# EAGLE design DTLJ_hexIO_v2 (EAGLE 7.2.0)
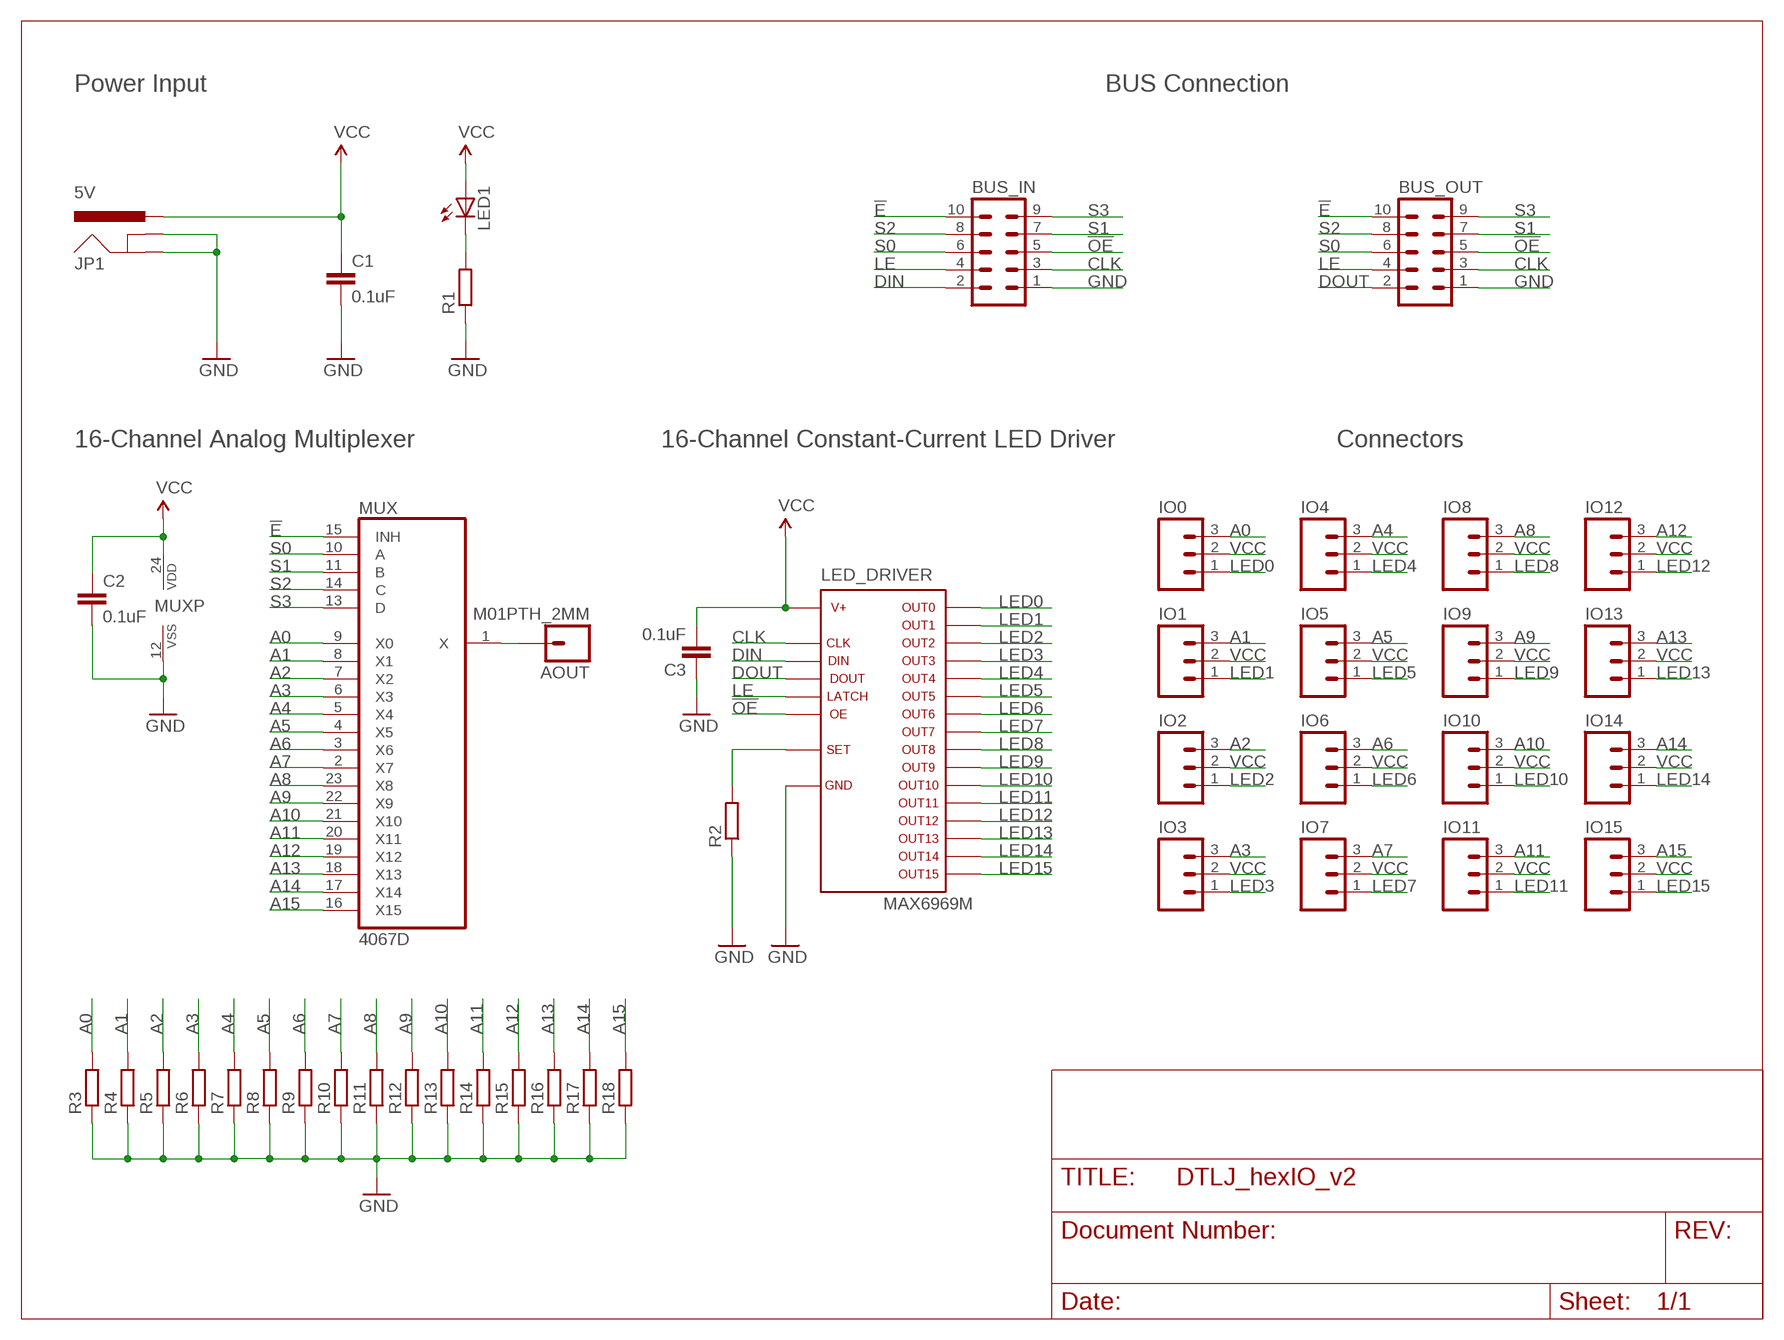
[diagram p0: schematic, sheet 1]

## Parts
AOUT  M01PTH_2MM  [1X01_2MM]
BUS_IN  ML10  [ML10]
BUS_OUT  ML10  [ML10]
C1  0.1uF  C-EUC1206  [C1206]
C2  0.1uF  C-EUC1206  [C1206]
C3  0.1uF  C-EUC1206  [C1206]
IO0  M03POLAR  [MOLEX-1X3]
IO1  M03POLAR  [MOLEX-1X3]
IO2  M03POLAR  [MOLEX-1X3]
IO3  M03POLAR  [MOLEX-1X3]
IO4  M03POLAR  [MOLEX-1X3]
IO5  M03POLAR  [MOLEX-1X3]
IO6  M03POLAR  [MOLEX-1X3]
IO7  M03POLAR  [MOLEX-1X3]
IO8  M03POLAR  [MOLEX-1X3]
IO9  M03POLAR  [MOLEX-1X3]
IO10  M03POLAR  [MOLEX-1X3]
IO11  M03POLAR  [MOLEX-1X3]
IO12  M03POLAR  [MOLEX-1X3]
IO13  M03POLAR  [MOLEX-1X3]
IO14  M03POLAR  [MOLEX-1X3]
IO15  M03POLAR  [MOLEX-1X3]
JP1  5V  POWER_JACKPTH_BREAD  [POWER_JACK_PTH_BREAD]
LED1  LEDSMT1206  [1206]
LED_DRIVER  MAX6969M  [SO24W]
MUX  4067D  [SO24W]
R1  R-EU_R1206  [R1206]
R2  R-EU_R1206  [R1206]
R3  R-EU_R1206  [R1206]
R4  R-EU_R1206  [R1206]
R5  R-EU_R1206  [R1206]
R6  R-EU_R1206  [R1206]
R7  R-EU_R1206  [R1206]
R8  R-EU_R1206  [R1206]
R9  R-EU_R1206  [R1206]
R10  R-EU_R1206  [R1206]
R11  R-EU_R1206  [R1206]
R12  R-EU_R1206  [R1206]
R13  R-EU_R1206  [R1206]
R14  R-EU_R1206  [R1206]
R15  R-EU_R1206  [R1206]
R16  R-EU_R1206  [R1206]
R17  R-EU_R1206  [R1206]
R18  R-EU_R1206  [R1206]

## Nets
!E: BUS_IN.10 BUS_OUT.10 MUX.15(INH)
!OE: BUS_IN.5 BUS_OUT.5 LED_DRIVER.21
A0: IO0.3 MUX.9(X0) R3.2
A1: IO1.3 MUX.8(X1) R4.2
A2: IO2.3 MUX.7(X2) R5.2
A3: IO3.3 MUX.6(X3) R6.2
A4: IO4.3 MUX.5(X4) R7.2
A5: IO5.3 MUX.4(X5) R8.2
A6: IO6.3 MUX.3(X6) R9.2
A7: IO7.3 MUX.2(X7) R10.2
A8: IO8.3 MUX.23(X8) R11.2
A9: IO9.3 MUX.22(X9) R12.2
A10: IO10.3 MUX.21(X10) R13.2
A11: IO11.3 MUX.20(X11) R14.2
A12: IO12.3 MUX.19(X12) R15.2
A13: IO13.3 MUX.18(X13) R16.2
A14: IO14.3 MUX.17(X14) R17.2
A15: IO15.3 MUX.16(X15) R18.2
CLK: BUS_IN.3 BUS_OUT.3 LED_DRIVER.3
DIN: BUS_IN.2 LED_DRIVER.2
DOUT: BUS_OUT.2 LED_DRIVER.22
GND [power]: BUS_IN.1 BUS_OUT.1 C1.2 C2.2 C3.1 JP1.GND JP1.GNDBREAK LED_DRIVER.1 MUX.12(VSS) R1.1 R2.1 R3.1 R4.1 R5.1 R6.1 R7.1 R8.1 R9.1 R10.1 R11.1 R12.1 R13.1 R14.1 R15.1 R16.1 R17.1 R18.1
LE: BUS_IN.4 BUS_OUT.4 LED_DRIVER.4
LED0: IO0.1 LED_DRIVER.5
LED1: IO1.1 LED_DRIVER.6
LED2: IO2.1 LED_DRIVER.7
LED3: IO3.1 LED_DRIVER.8
LED4: IO4.1 LED_DRIVER.9
LED5: IO5.1 LED_DRIVER.10
LED6: IO6.1 LED_DRIVER.11
LED7: IO7.1 LED_DRIVER.12
LED8: IO8.1 LED_DRIVER.13
LED9: IO9.1 LED_DRIVER.14
LED10: IO10.1 LED_DRIVER.15
LED11: IO11.1 LED_DRIVER.16
LED12: IO12.1 LED_DRIVER.17
LED13: IO13.1 LED_DRIVER.18
LED14: IO14.1 LED_DRIVER.19
LED15: IO15.1 LED_DRIVER.20
N$1: LED1.C R1.2
N$2: LED_DRIVER.23 R2.2
N$3: AOUT.1 MUX.1(X)
S0: BUS_IN.6 BUS_OUT.6 MUX.10(A)
S1: BUS_IN.7 BUS_OUT.7 MUX.11(B)
S2: BUS_IN.8 BUS_OUT.8 MUX.14(C)
S3: BUS_IN.9 BUS_OUT.9 MUX.13(D)
VCC [power]: C1.1 C2.1 C3.2 IO0.2 IO1.2 IO2.2 IO3.2 IO4.2 IO5.2 IO6.2 IO7.2 IO8.2 IO9.2 IO10.2 IO11.2 IO12.2 IO13.2 IO14.2 IO15.2 JP1.PWR LED1.A LED_DRIVER.24 MUX.24(VDD)

## Notes on the sheet
- Power Input | BUS Connection
- 16-Channel Analog Multiplexer | 16-Channel Constant-Current LED Driver | Connectors

## Library data of the parts
AOUT = SparkFun-Connectors:M01: Header 1 Standard 1-pin 0.1" header. Use with straight break away headers (SKU : PRT-00116), right angle break away headers (PRT-00553), swiss pins (PRT-00743), machine pins (PRT-00117), and female headers (PRT-00115).
BUS_IN BUS_OUT = con-ml:ML10: HARTING; OC_FARNELL: unknown; OC_NEWARK: unknown
C1-C3 = rcl:C-EU: CAPACITOR, European symbol
IO0 IO1-IO15 = SparkFun-Connectors:M03: Header 3 Standard 3-pin 0.1" header. Use with straight break away headers (SKU : PRT-00116), right angle break away headers (PRT-00553), swiss pins (PRT-00743), machine pins (PRT-00117), and female headers (PRT-00115). Molex polarized connector foot print use with SKU : PRT-08232 with associated crimp pins and housings.
JP1 = SparkFun-Connectors:POWER_JACK: Power Jack This is the standard 5.5mm barrel jack for power. The PTH is the most common, proven, reliable, footprint. The Slot footprint only works if the mill layer is transmitted to the PCB fab house so be warned. Mating wall wart : TOL-00298 (and others); PROD_ID: PRT-10811
LED1 = led:LED: LED OSRAM: - CHIPLED LG R971, LG N971, LY N971, LG Q971, LY Q971, LO R971, LY R971 LH N974, LH R974 LS Q976, LO Q976, LY Q976 LO Q996 - Hyper CHIPLED LW Q18S LB Q993, LB Q99A, LB R99A - SideLED LS A670, LO A670, LY A670, LG A670, LP A670 LB A673, LV A673, LT A673, LW A673 LH A674 LY A675 LS A676, LA A676, LO A676, LY A676, LW A676 LS A679, LY A679, LG A679 - Hyper Micro SIDELED® LS Y876, LA Y876, LO Y876, LY Y876 LT Y87S - SmartLED LW L88C, LW L88S LB L89C, LB L89S, LG L890 LS L89K, LO L89K, LY L89K LS L896, LA L896, LO L896, LY L896 - TOPLED LS T670, LO T670, LY T670, LG T670, LP T670 LSG T670, LSP T670, LSY T670, LOP T670, LYG T670 LG T671, LOG T671, LSG T671 LB T673, LV T673, LT T673, LW T673 LH T674 LS T676, LA T676, LO T676, LY T676, LB T676, LH T676, LSB T676, LW T676 LB T67C, LV T67C, LT T67C, LS T67K, LO T67K, LY T67K, LW E67C LS E67B, LA E67B, LO E67B, LY E67B, LB E67C, LV E67C, LT E67C LW T67C LS T679, LY T679, LG T679 LS T770, LO T770, LY T770, LG T770, LP T770 LB T773, LV T773, LT T773, LW T773 LH T774 LS E675, LA E675, LY E675, LS T675 LS T776, LA T776, LO T776, LY T776, LB T776 LHGB T686 LT T68C, LB T68C - Hyper Mini TOPLED® LB M676 - Mini TOPLED Santana® LG M470 LS M47K, LO M47K, LY M47K Source: http://www.osram.convergy.de LUXEON: - LUMILED® LXK2-PW12-R00, LXK2-PW12-S00, LXK2-PW14-U00, LXK2-PW14-V00 LXK2-PM12-R00, LXK2-PM12-S00, LXK2-PM14-U00 LXK2-PE12-Q00, LXK2-PE12-R00, LXK2-PE12-S00, LXK2-PE14-T00, LXK2-PE14-U00 LXK2-PB12-K00, LXK2-PB12-L00, LXK2-PB12-M00, LXK2-PB14-N00, LXK2-PB14-P00, LXK2-PB14-Q00 LXK2-PR12-L00, LXK2-PR12-M00, LXK2-PR14-Q00, LXK2-PR14-R00 LXK2-PD12-Q00, LXK2-PD12-R00, LXK2-PD12-S00 LXK2-PH12-R00, LXK2-PH12-S00 LXK2-PL12-P00, LXK2-PL12-Q00, LXK2-PL12-R00 Source: www.luxeon.com KINGBRIGHT: KA-3528ASYC Source: www.kingbright.com
LED_DRIVER = max6969:MAX6969
MUX = 40xx:4067: 16-channel ANALOG MULTIPLEXER
R1-R18 = rcl:R-EU_: RESISTOR, European symbol

## Net classes
0 default: width 0.508 mm, drill 0.33 mm, clearance 0.254 mm
1 power: width 0.889 mm, drill 0.33 mm, clearance 0.381 mm

## Board
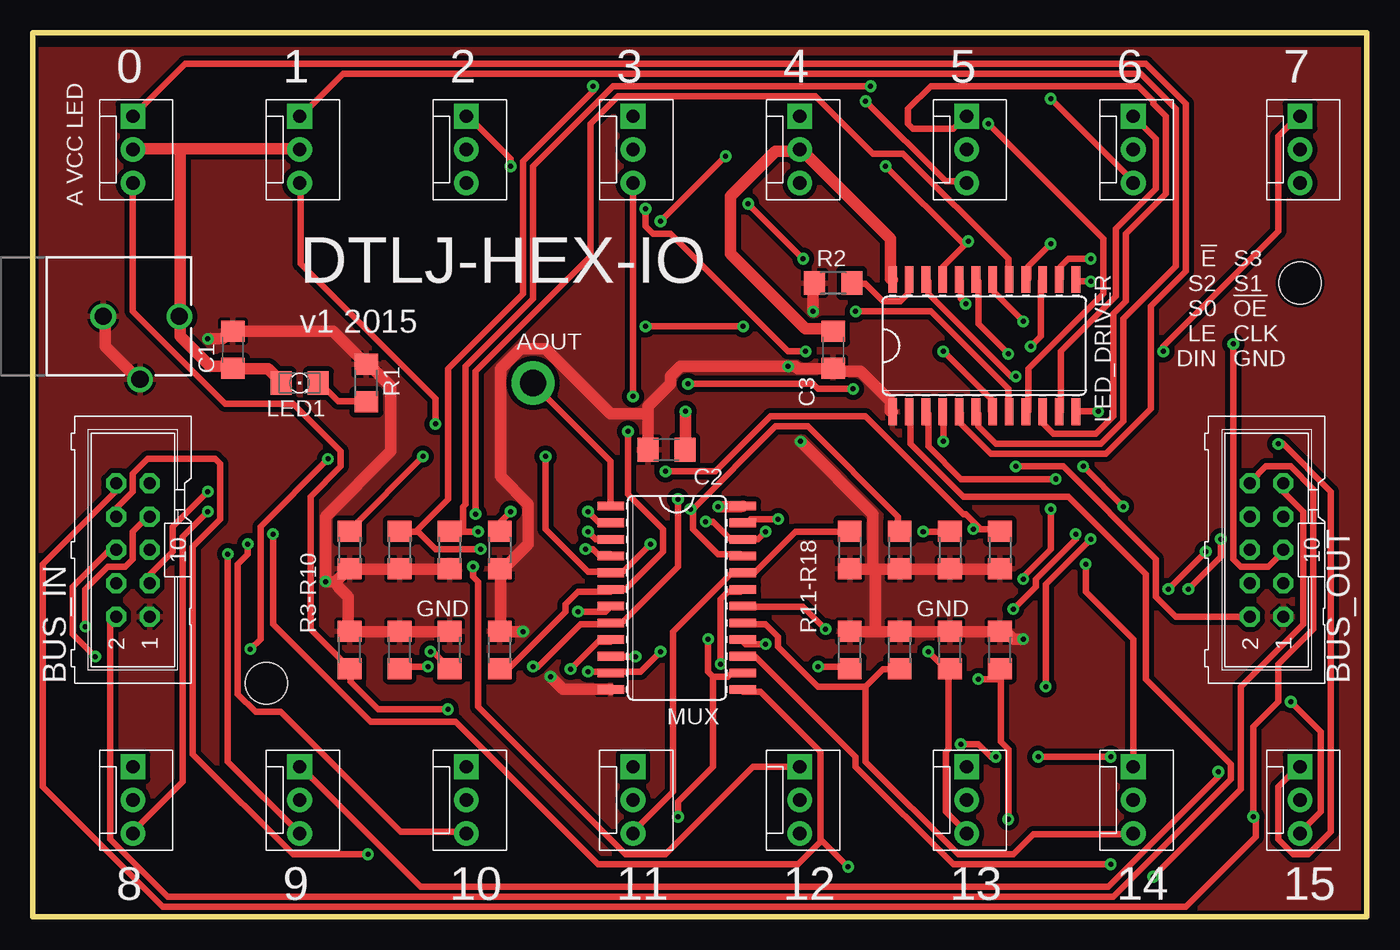
[diagram p1: board, top side]
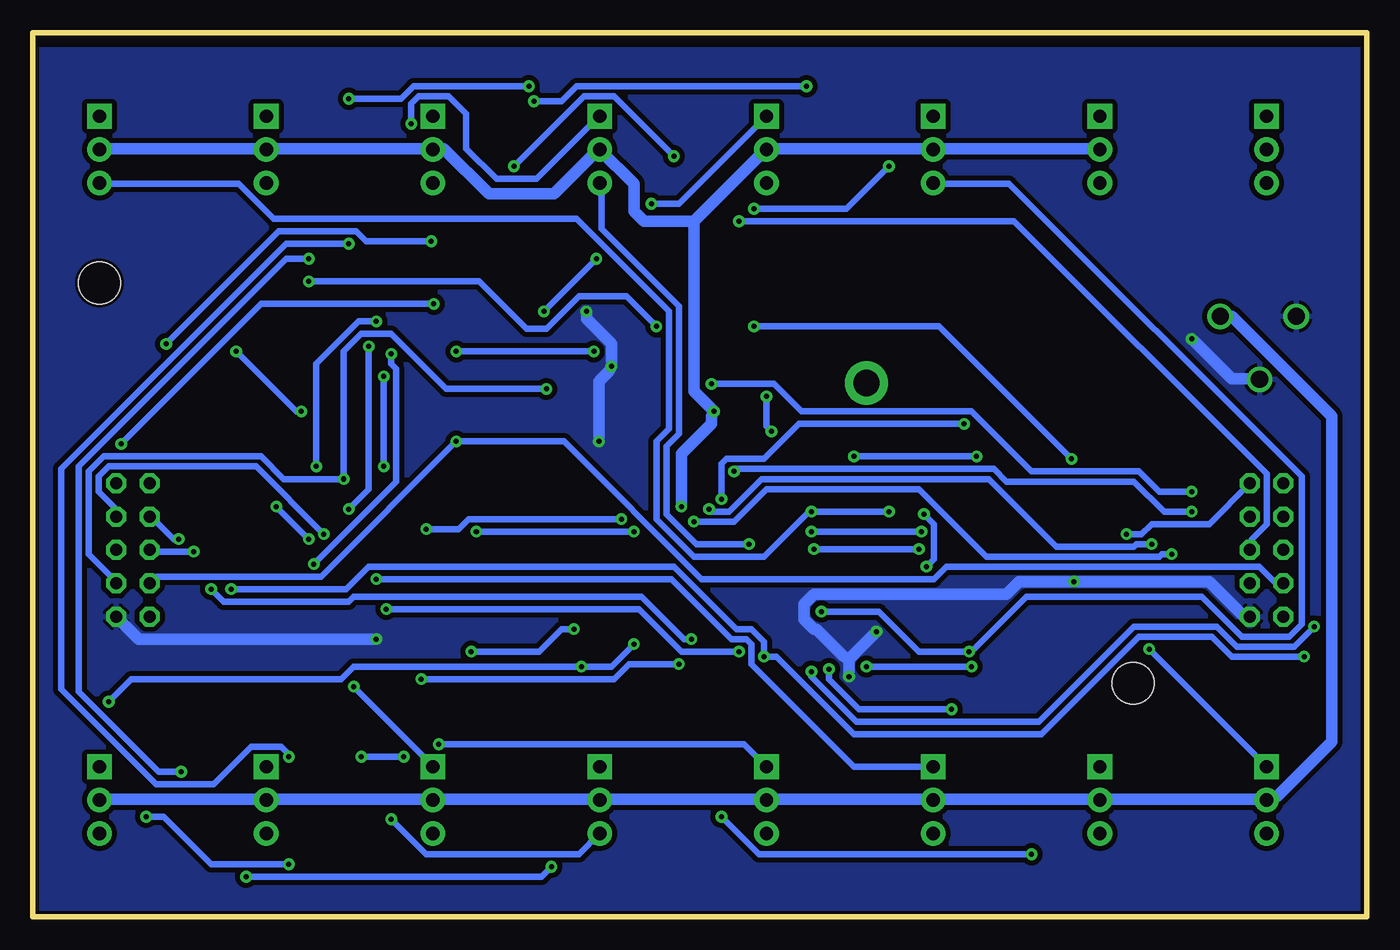
[diagram p2: board, bottom side, seen from below]

Size 101.6 x 67.31 mm. Coordinates in mm from the lower left corner, seen from the top.
Outline: 0,2.54 0,0
Outline: 0,0 101.6,0 101.6,67.31 0,67.31 0,0
Copper layers (1*16): Top 0.035mm / dielectric 1.5mm / Bottom 0.035mm
Design rules "20trace-10clearance": minimum track width 20mil, minimum drill 15mil, track to track 10mil, track to pad 10mil, pad to pad 10mil, via to via 10mil, smd to smd 10mil, copper to edge 10mil, drill to drill 10mil, minimum pad ring 12mil, minimum via ring 10mil, stop-mask expansion 4mil, vias tented up to drill 20mil, thermal gap 10mil
Holes 3.2 mm at 96.52,48.26 17.78,17.78

### Footprints (pad centres in the part's own frame; a part is rotated, then mirrored left to right if it is on the bottom)
1X01_2MM = drill 2 pad 3.302: 1 0,0
ML10 = drill 0.914 octagon: 1 -5.08,-1.27; 2 -5.08,1.27; 3 -2.54,-1.27; 4 -2.54,1.27; 5 0,-1.27; 6 0,1.27; 7 2.54,-1.27; 8 2.54,1.27; 9 5.08,-1.27; 10 5.08,1.27
C1206 = smd 1.6 x 1.8: 1 -1.4,0; 2 1.4,0
MOLEX-1X3 = drill 1.016 pad 1.88 square: 1 0,0 | drill 1.016 pad 1.88: 2 2.54,0; 3 5.08,0
POWER_JACK_PTH_BREAD = drill 1.3: GND 0,7.9; GNDBREAK 4.8,10.7; PWR 0,13.7
1206 = smd 1.6 x 1.803: A -1.422,0; C 1.422,0
SO24W = smd 0.66 x 2.032: 1 -6.985,-5.029; 2 -5.715,-5.029; 3 -4.445,-5.029; 4 -3.175,-5.029; 5 -1.905,-5.029; 6 -0.635,-5.029; 7 0.635,-5.029; 8 1.905,-5.029; 9 3.175,-5.029; 10 4.445,-5.029; 11 5.715,-5.029; 12 6.985,-5.029; 13 6.985,5.029; 14 5.715,5.029; 15 4.445,5.029; 16 3.175,5.029; 17 1.905,5.029; 18 0.635,5.029; 19 -0.635,5.029; 20 -1.905,5.029; 21 -3.175,5.029; 22 -4.445,5.029; 23 -5.715,5.029; 24 -6.985,5.029
R1206 = smd 1.6 x 1.803: 1 -1.422,0; 2 1.422,0

### Placement (x,y rotation side)
AOUT  38.1,40.64 0 top
BUS_IN  7.62,27.94 90 top
BUS_OUT  93.98,27.94 90 top
C1  15.24,43.18 90 top
C2  48.26,35.56 180 top
C3  60.96,43.18 90 top
IO0  7.62,60.96 270 top
IO1  20.32,60.96 270 top
IO2  33.02,60.96 270 top
IO3  45.72,60.96 270 top
IO4  58.42,60.96 270 top
IO5  71.12,60.96 270 top
IO6  83.82,60.96 270 top
IO7  96.52,60.96 270 top
IO8  7.62,11.43 270 top
IO9  20.32,11.43 270 top
IO10  33.02,11.43 270 top
IO11  45.72,11.43 270 top
IO12  58.42,11.43 270 top
IO13  71.12,11.43 270 top
IO14  83.82,11.43 270 top
IO15  96.52,11.43 270 top
JP1  -2.54,45.72 270 top
LED1  20.32,40.64 0 top
LED_DRIVER  72.47,43.49 0 top
MUX  49.05,24.29 270 top
R1  25.4,40.64 270 top
R2  60.96,48.26 0 top
R3  24.13,20.32 270 top
R4  27.94,20.32 270 top
R5  31.75,20.32 270 top
R6  35.56,20.32 270 top
R7  24.13,27.94 90 top
R8  27.94,27.94 90 top
R9  31.75,27.94 90 top
R10  35.56,27.94 90 top
R11  73.66,27.94 90 top
R12  69.85,27.94 90 top
R13  66.04,27.94 90 top
R14  62.23,27.94 90 top
R15  73.66,20.32 270 top
R16  69.85,20.32 270 top
R17  66.04,20.32 270 top
R18  62.23,20.32 270 top

### Tracks (layer width: path | path; a pad name or v marks a point on that pad's centre or on a via)
!E  (via drill 0.38)
  Top 0.508: v82.11,4 70.1,4 62.67,11.43 62.67,12.19 55.05,19.81 54.1,19.81 MUX.15 | BUS_OUT.10 92.77,33.15 93.92,34.29 95.82,34.29 97.54,32.58 97.54,21.91 94.87,19.24 94.87,16.38 92.96,14.48 v92.96,7.62 93.15,7.62 93.15,6.1 87.82,0.76 9.91,0.76 0.76,9.91 0.76,26.86 6.29,32.38 6.29,32.96 BUS_IN.10
  Bottom 0.508: v82.11,4 88.01,4 91.63,7.62 v92.96,7.62
!OE  (via drill 0.38)
  Top 0.508: v91.44,43.62 91.44,27.24 92.01,26.67 94.11,26.67 95.25,27.81 BUS_OUT.5 | LED_DRIVER.21 69.34,48.58 69.34,49.53 v71.25,51.44 70.87,51.24 v64.96,57.15 | v52.77,57.91 v47.82,52.96
  Bottom 0.508: v71.25,51.44 76.2,51.44 76.96,52.2 82.87,52.2 v91.44,43.62 | v47.82,52.96 26.86,52.96 7.62,33.72 7.62,29.91 8.76,28.77 8.76,28 BUS_IN.5 | v52.77,57.91 57.34,62.48 59.63,62.48 v64.96,57.15
A0  (via drill 0.38)
  Top 0.508: IO0.3 7.62,46.1 14.67,39.05 19.81,39.05 23.43,35.43 23.43,34.29 21.14,32 21.14,21.91 24,19.05 R3.2 24.19,18.67 24.19,17.91 26.29,15.81 v31.62,15.81 | v40.96,18.86 43.05,20.95 44.01,20.95 MUX.9
  Bottom 0.508: v40.96,18.86 40.96,18.1 38.67,15.81 v31.62,15.81
A1  (via drill 0.38)
  Top 0.508: v30.1,19.05 28,19.05 R4.2 | v38.1,19.05 38.48,19.05 41.72,22.29 44.01,22.29 MUX.8 44.2,22.48 44.96,22.48 49.15,26.67 v49.15,31.81 | v30.67,37.53 30.67,39.43 20.38,49.72 20.38,55.82 IO1.3
  Bottom 0.508: v38.1,19.05 v30.1,19.05 | v30.67,37.53 43.24,37.53 45.91,34.86 48.77,34.86 49.15,34.48 v49.15,31.81
A2  (via drill 0.38)
  Top 0.508: v30.29,20.19 30.48,20.19 31.62,19.05 R5.2 | v41.53,23.24 43.62,23.24 44.01,23.62 MUX.7
  Bottom 0.508: v41.53,23.24 37.15,23.24 34.1,20.19 v30.29,20.19 30.1,20.19 25.91,24.38 12.57,24.38 9.53,21.34 5.91,21.34 4.95,22.29 4.95,33.53 27.24,55.82 32.96,55.82 IO2.3
A3  (via drill 0.38)
  Top 0.508: R6.2 35.62,19.05 36.39,19.05 40.58,23.24 40.58,23.81 41.53,24.77 44.01,24.77 MUX.6 44.2,24.96 45.15,24.96 48.01,27.81 48.01,29.53 45.34,32.19 v45.34,36.96 | v45.72,39.62 IO3.3
  Bottom 0.508: v45.72,39.62 45.72,37.34 v45.34,36.96
A4  (via drill 0.38)
  Top 0.508: v29.72,35.05 24.19,29.53 R7.2 | v39.05,35.05 39.05,29.53 42.29,26.29 44.01,26.29 MUX.5 44.2,26.29 44.96,26.29 v47.05,28.38
  Bottom 0.508: v39.05,35.05 v29.72,35.05 | v47.05,28.38 51.05,28.38 53.34,30.67 53.34,35.81 52.39,36.77 52.39,46.48 58.29,52.39 58.29,55.82 IO4.3
A5  (via drill 0.38)
  Top 0.508: 29.34,29.34 28,29.34 R8.2 | 29.34,29.34 30.67,28 v34.1,28 | v42.1,28 42.67,28 43.05,27.62 44.01,27.62 MUX.4 | v63.44,62.1 69.53,56.01 71.06,56.01 IO5.3 | v42.67,63.25 42.67,62.87 37.34,57.53 37.34,47.43 31.62,41.72 31.62,31.81 29.34,29.53 29.34,29.34
  Bottom 0.508: v42.1,28 v34.1,28 | v63.44,62.1 61.34,62.1 60.2,63.25 v42.67,63.25
A6  (via drill 0.38)
  Top 0.508: v33.91,29.34 32.77,29.34 | 32.77,29.34 31.81,29.34 R9.2 | v42.29,29.34 42.86,28.77 44.01,28.77 MUX.3 | v77.53,62.29 83.82,56.01 IO6.3 | v63.82,63.25 44.2,63.25 38.1,57.15 38.1,47.05 32.96,41.91 32.96,31.43 32.77,31.24 32.77,29.34
  Bottom 0.508: v42.29,29.34 v33.91,29.34 | v77.53,62.29 73.53,62.29 72.58,63.25 v63.82,63.25
A7  (via drill 0.38)
  Top 0.508: v36.39,30.86 35.62,30.1 35.62,29.53 R10.2 | v42.29,30.86 43.05,30.1 44.01,30.1 MUX.2
  Bottom 0.508: v36.39,30.86 v42.29,30.86 42.48,30.86 45.91,27.43 51.24,27.43 54.1,30.29 54.1,36.2 53.15,37.15 53.15,46.1 60.2,53.15 83.25,53.15 85.92,55.82 96.39,55.82 IO7.3
A8  (via drill 0.38)
  Top 0.508: v56.77,30.29 54.67,30.29 54.48,30.1 54.1,30.1 MUX.23 | R11.2 73.53,29.53 v71.63,29.53 72.01,29.72 71.06,30.67 70.87,30.67 63.44,38.1 56.2,38.1 52.01,33.91 v48.2,33.91 | v13.34,30.86 11.43,28.96 11.43,10.29 7.62,6.48 IO8.3
  Bottom 0.508: v71.63,29.53 69.15,29.53 68.39,30.29 v56.77,30.29 | v13.34,30.86 15.43,30.86 17.72,33.15 27.43,33.15 28.38,34.1 48.01,34.1 v48.2,33.91
A9  (via drill 0.38)
  Top 0.508: v67.82,29.34 69.72,29.34 R12.2 | v55.82,29.34 55.24,28.77 54.1,28.77 MUX.22 53.91,28.77 53.15,28.77 51.82,30.1 v51.24,30.1 | IO9.3 14.86,11.81 v14.86,27.62
  Bottom 0.508: v55.82,29.34 v67.82,29.34 | v14.86,27.62 15.62,27.62 15.81,27.43 28.96,27.43 34.1,32.58 45.72,32.58 48.2,30.1 v51.24,30.1
A10  (via drill 0.38)
  Top 0.508: 50.29,31.05 56.58,37.34 59.05,37.34 65.91,30.48 65.91,29.53 R13.2 | 50.29,31.05 50.29,29.53 52.2,27.62 53.91,27.62 MUX.21 | v16.38,28.38 16.38,27.62 15.62,26.86 15.62,16.95 16.95,15.62 18.86,15.62 28,6.48 32.96,6.48 IO10.3 | v50.1,31.05 50.29,31.05
  Bottom 0.508: v16.38,28.38 17.53,28.38 17.72,28.19 23.62,28.19 28.77,33.34 46.1,33.34 48.58,30.86 49.91,30.86 v50.1,31.05
A11
  Top 0.508: R14.2 62.1,29.34 58.1,29.34 55.05,26.29 54.1,26.29 MUX.20 53.91,26.1 53.15,26.1 48.77,21.72 48.77,9.53 45.72,6.48 IO11.3
A12  (via drill 0.38)
  Top 0.508: 73.72,18.1 73.72,13.34 74.3,12.76 v74.3,7.43 | 73.72,18.1 73.72,18.86 R15.2 | v52.39,19.24 52.39,24.19 52.96,24.77 53.91,24.77 MUX.19 | 73.72,18.1 v72.01,18.1
  Bottom 0.508: v74.3,7.43 71.63,4.76 60.01,4.76 IO12.3 | v52.39,19.24 56.2,19.24 57.34,18.1 v72.01,18.1
A13  (via drill 0.38)
  Top 0.508: IO13.3 71.06,6.48 69.53,8 69.53,12.57 69.72,12.76 69.72,18.86 R16.2 69.53,18.86 v68.2,20.19 | v60.39,21.91 58.67,23.62 54.1,23.62 MUX.18
  Bottom 0.508: v60.39,21.91 61.34,21.91 63.06,20.19 v68.2,20.19
A14
  Top 0.508: 63.44,17.53 64.77,18.86 65.91,18.86 R17.2 | 63.44,17.53 59.82,17.53 56.77,20.57 56.77,21.34 55.82,22.29 54.1,22.29 MUX.17 | 63.44,17.53 63.44,11.81 70.48,4.76 74.68,4.76 76.2,6.29 83.82,6.29 IO14.3
A15  (via drill 0.38)
  Top 0.508: v59.82,19.05 62.1,19.05 R18.2 | v55.82,20.77 54.29,20.77 54.1,20.95 MUX.16 | v95.82,16.38 98.11,14.1 98.11,8 96.58,6.48 IO15.3
  Bottom 0.508: v55.82,20.77 57.53,19.05 v59.82,19.05 77.15,19.05 78.11,18.1 94.11,18.1 v95.82,16.38
CLK  (via drill 0.38)
  Top 0.508: v77.92,33.34 70.67,33.34 68.2,35.81 68.2,38.29 LED_DRIVER.3 | v13.34,32.38 10.67,29.72 10.67,27.81 8.95,26.1 8.95,25.53 BUS_IN.3 | v49.91,40.58 59.44,40.58 59.82,40.2 v62.48,40.2
  Bottom 0.508: BUS_OUT.3 95.25,25.53 97.35,27.62 97.35,33.91 96.2,35.05 84.2,35.05 82.49,33.34 v77.92,33.34 77.92,43.05 76.58,44.39 74.3,44.39 70.1,40.2 v62.48,40.2 | v13.34,32.38 15.81,32.38 17.34,33.91 25.53,33.91 30.1,38.48 43.05,38.48 45.15,40.58 v49.91,40.58
DIN
  Top 0.508: LED_DRIVER.2 66.86,38.29 66.86,36.01 70.87,32 78.87,32 84.77,26.1 84.77,18.1 91.25,11.62 91.25,10.48 82.3,1.52 10.29,1.52 5.91,5.91 5.91,22.48 6.29,22.86 BUS_IN.2
DOUT  (via drill 0.38)
  Top 0.508: v74.87,41.15 74.49,41.15 68.2,47.43 68.2,48.39 LED_DRIVER.22 | v74.87,34.29 78.49,34.29 85.53,27.24 85.53,24.38 87.06,22.86 BUS_OUT.2
  Bottom 0.508: v74.87,34.29 v74.87,41.15
GND  (via drill 0.38)
  Top 0.889: 64.2,26.48 65.91,26.48 R13.1 66.48,26.48 69.72,26.48 R12.1 70.29,26.48 73.53,26.48 R11.1 | 64.2,26.48 64.01,26.48 | 64.01,26.48 62.29,26.48 R14.1 | 64.2,21.72 65.91,21.72 R17.1 66.48,21.72 69.72,21.72 R16.1 70.29,21.72 73.53,21.72 R15.1 74.11,21.72 74.68,21.14 v75.44,21.14 | 64.2,21.72 62.29,21.72 R18.1 | 64.2,21.72 64.2,26.48 | 46.86,38.29 46.86,38.86 48.58,40.58 48.58,41.15 49.34,41.91 v57.53,41.91 58.1,41.91 58.29,41.72 60.96,41.72 C3.1 61.34,41.53 63.06,41.53 65.34,39.24 65.34,38.48 LED_DRIVER.1 | 46.86,38.29 46.86,35.62 C2.2 | v59.44,46.1 59.44,48.2 R2.1 | v39.43,18.29 40.39,17.34 44.01,17.34 MUX.12 | v37.34,21.72 36.01,21.72 R6.1 35.62,21.91 35.62,26.48 R10.1 36.01,26.67 37.72,28.38 37.72,31.43 35.62,33.53 35.62,41.72 37.15,43.24 39.05,43.24 44.01,38.29 46.86,38.29 | JP1.GND 5.52,45.72 5.52,43.43 8,40.96 JP1.GNDBREAK | R5.1 31.62,21.72 28.38,21.72 R4.1 27.81,21.72 24.19,21.72 R3.1 24,22.1 24,24.38 23.24,25.15 23.05,25.53 | R9.1 31.62,26.48 28.38,26.48 R8.1 27.81,26.48 24.19,26.48 R7.1 23.81,26.29 23.05,25.53 | 23.05,25.53 v22.29,25.53 22.29,30.48 27.24,35.43 27.24,40.39 25.72,41.91 R1.1 25.34,42.1 22.86,44.58 C1.2 14.86,44.39 14.48,44.01 v13.34,44.01 | 64.01,26.48 64.01,30.67 v58.48,36.2
  Bottom 0.889: BUS_OUT.1 93.53,21.14 v75.44,21.14 | v59.44,46.1 59.44,45.53 57.53,43.62 v57.53,41.91 57.72,41.53 58.48,40.77 v58.48,36.2 | 39.43,19.62 v39.43,18.29 | v37.34,21.72 39.43,19.62 | BUS_IN.1 9.34,22.86 12,25.53 v22.29,25.53 26.48,25.53 27.43,24.57 42.1,24.57 42.86,23.81 42.86,22.67 42.1,21.91 41.91,21.91 39.81,19.81 39.43,19.62 | v13.34,44.01 10.29,40.96 8.19,40.96 JP1.GNDBREAK
  pour Bottom: 0,0 101.6,0 101.6,66.04 0,66.04
  pour Top: 0,0 101.6,0 101.6,66.04 0,66.04
LE  (via drill 0.38)
  Top 0.508: v69.34,36.2 69.34,38.29 LED_DRIVER.4
  Bottom 0.508: BUS_OUT.4 92.2,25.91 79.63,25.91 v69.34,36.2 61.15,36.2 50.67,25.72 32.96,25.72 32,26.67 8.19,26.67 7.05,25.53 6.48,25.53 BUS_IN.4
LED0
  Top 0.508: IO0.1 11.62,64.96 84.77,64.96 87.82,61.91 87.82,49.15 85.15,46.48 85.15,38.67 81.72,35.24 72.96,35.24 70.67,37.53 70.67,38.29 LED_DRIVER.5
LED1
  Top 0.508: LED_DRIVER.6 72.01,38.29 72.01,37.34 73.34,36.01 81.34,36.01 83.06,37.72 83.06,45.53 87.06,49.53 87.06,61.53 84.39,64.2 23.62,64.2 20.38,60.96 IO1.1
LED2  (via drill 0.38)
  Top 0.508: v69.34,43.05 72.96,39.43 72.96,38.48 LED_DRIVER.7 | v58.86,43.05 57.53,43.05 48.58,52.01 47.24,52.01 46.67,52.58 v46.67,53.91 | v36.39,57.15 36.39,57.72 33.15,60.96 IO2.1
  Bottom 0.508: v58.86,43.05 v69.34,43.05 | v46.67,53.91 39.62,53.91 v36.39,57.15
LED3  (via drill 0.38)
  Top 0.508: v62.67,46.1 68.39,46.1 74.3,40.2 74.3,38.48 LED_DRIVER.8 | v54.48,54.29 v58.67,50.1
  Bottom 0.508: v58.67,50.1 v62.67,46.1 | v54.48,54.29 52.39,54.29 IO3.1
LED4  (via drill 0.38)
  Top 0.508: v72.77,60.39 81.53,51.63 81.53,47.43 75.82,41.72 75.82,38.48 LED_DRIVER.9
  Bottom 0.508: v72.77,60.39 72.77,61.91 72.2,62.48 69.91,62.48 68.58,61.15 68.58,58.48 66.29,56.2 63.25,56.2 58.48,60.96 IO4.1
LED5
  Top 0.508: LED_DRIVER.10 76.96,38.29 76.96,37.53 77.72,36.77 80.96,36.77 82.3,38.1 82.3,45.91 83.25,46.86 83.25,52.01 86.3,55.05 86.3,60.96 85.34,61.91 85.34,62.1 84.2,63.25 68.39,63.25 66.67,61.53 66.67,60.39 67.06,60.01 70.1,60.01 71.06,60.96 IO5.1
LED6
  Top 0.508: IO6.1 85.53,59.24 85.53,55.44 82.49,52.39 82.49,47.24 78.3,43.05 78.3,38.48 LED_DRIVER.11
LED7  (via drill 0.38)
  Top 0.508: v81.15,38.48 79.63,38.48 LED_DRIVER.12 | v86.11,43.05 86.11,43.43 94.87,52.2 94.87,59.44 96.39,60.96 IO7.1
  Bottom 0.508: v81.15,38.48 81.53,38.48 v86.11,43.05
LED8  (via drill 0.38)
  Top 0.508: v80.58,48.39 79.63,48.39 LED_DRIVER.13 | v46.67,44.96 v54.1,44.96 | v22.48,34.86 17.34,29.72 17.34,21.14 v16.57,20.38
  Bottom 0.508: v80.58,48.39 67.63,48.39 64.01,44.77 62.48,44.77 60.01,47.24 56.39,47.24 v54.1,44.96 | v46.67,44.96 32.58,44.96 v22.48,34.86 | IO8.1 v16.57,20.38
LED9  (via drill 0.38)
  Top 0.508: v80.58,50.1 78.87,50.1 78.3,49.53 78.3,48.58 LED_DRIVER.14 | v90.3,11.05 90.3,10.67 81.92,2.29 29.53,2.29 20.38,11.43 IO9.1
  Bottom 0.508: v80.58,50.1 82.3,50.1 98.11,34.29 98.11,17.14 92.01,11.05 v90.3,11.05
LED10  (via drill 0.38)
  Top 0.508: v76.01,43.43 76.77,44.2 76.77,48.39 LED_DRIVER.15 | v77.53,31.05 77.53,28 75.44,25.91 v75.44,25.72
  Bottom 0.508: v76.01,43.43 76.01,32.58 v77.53,31.05 | v75.44,25.72 52.96,25.72 48.39,21.14 47.24,21.14 46.86,20.77 46.86,19.24 39.05,11.43 IO10.1
LED11  (via drill 0.38)
  Top 0.508: v77.53,51.24 75.82,49.53 75.82,48.58 LED_DRIVER.16 | v76.58,12.19 v82.11,12.19 | v73.34,12.19 72.96,12.19 72.01,13.14 v70.67,13.14
  Bottom 0.508: v77.53,51.24 82.3,51.24 99.44,34.1 99.44,17.34 92.2,10.1 87.82,10.1 84.96,12.95 82.68,12.95 82.11,12.38 v82.11,12.19 | v73.34,12.19 v76.58,12.19 | v70.67,13.14 47.43,13.14 IO11.1
LED12  (via drill 0.38)
  Top 0.508: v33.72,30.67 33.72,41.53 42.48,50.29 42.48,60.39 44.58,62.48 59.63,62.48 64.01,58.1 66.29,58.1 74.3,50.1 74.3,48.58 LED_DRIVER.17 | v33.53,26.67 33.53,25.91 33.91,25.53 33.91,16 45.15,4.76 48.2,4.76 54.86,11.43 IO12.1
  Bottom 0.508: v33.72,30.67 32.96,29.91 32.96,27.24 v33.53,26.67
LED13  (via drill 0.38)
  Top 0.508: v75.44,45.34 73.15,47.62 73.15,48.39 LED_DRIVER.18 | v83.06,31.24 v80.01,34.29 | v80.58,28.77 77.15,25.34 v77.15,17.53
  Bottom 0.508: v75.44,45.34 76.77,45.34 80.01,42.1 v80.01,34.29 | v80.58,28.77 v83.06,31.24 | v77.15,17.53 71.06,11.43 IO13.1
LED14  (via drill 0.38)
  Top 0.508: v74.3,42.86 72.01,45.15 72.01,48.39 LED_DRIVER.19 | v80.2,26.86 80.2,24.77 83.82,21.14 IO14.1
  Bottom 0.508: v74.3,42.86 74.3,42.1 73.91,41.72 73.91,33.15 v80.2,26.86
LED15  (via drill 0.38)
  Top 0.508: v71.06,46.67 70.67,47.05 70.67,48.39 LED_DRIVER.20 | v94.87,36.01 95.25,36.01 98.87,32.38 98.87,6.48 97.16,4.76 96.01,4.76 94.87,5.91 94.87,9.91 96.39,11.43 IO15.1
  Bottom 0.508: v71.06,46.67 84.2,46.67 v94.87,36.01
N$1
  Top 0.508: R1.2 25.34,39.24 23.24,39.24 21.91,40.58 LED1.C
N$2
  Top 0.508: R2.2 62.48,48.2 63.44,48.2 64.77,46.86 66.1,46.86 66.67,47.43 66.67,48.39 LED_DRIVER.23
N$3
  Top 0.508: MUX.1 44.01,31.43 44.01,34.67 38.1,40.58 AOUT.1
S0  (via drill 0.38)
  Top 0.508: v45.91,19.81 44.2,19.81 MUX.10 | v4.76,19.81 3.05,21.53 3.05,25.15 5.71,27.81 6.29,27.81 BUS_IN.6 | v86.49,24.96 v89.34,27.81
  Bottom 0.508: v4.76,19.81 10.29,19.81 11.81,21.34 17.34,21.34 24.77,13.91 39.05,13.91 44.96,19.81 v45.91,19.81 45.91,20.95 46.86,21.91 48.01,21.91 52.77,26.67 76.01,26.67 77.72,24.96 v86.49,24.96 | v89.34,27.81 92.58,27.81 BUS_OUT.6
S1  (via drill 0.38)
  Top 0.508: v42.29,18.67 44.01,18.67 MUX.11 44.2,18.67 46.29,18.67 v47.82,20.19 | v4,22.1 4,24.96 5.71,26.67 7.05,26.67 7.62,27.24 7.62,29.34 8.76,30.48 BUS_IN.7 | v79.44,29.15 79.44,28.77 76.39,25.72 76.39,25.15 v74.68,23.43
  Bottom 0.508: v42.29,18.67 42.29,18.29 38.86,14.86 24.96,14.86 17.72,22.1 11.43,22.1 9.91,20.57 5.52,20.57 v4,22.1 | BUS_OUT.7 95.25,31.05 96.58,32.38 96.58,33.53 95.82,34.29 84.58,34.29 v79.44,29.15 | v74.68,23.43 55.44,23.43 52.2,20.19 v47.82,20.19
S2  (via drill 0.38)
  Top 0.508: 51.82,18.29 52.96,18.29 53.15,18.48 53.91,18.48 MUX.14 | 51.82,18.29 51.44,18.67 v51.44,21.14 | v88.01,24.96 90.49,27.43 v90.49,28.77 | v25.53,4.76 19.81,4.76 12.19,12.38 12.19,28.19 14.29,30.29 14.29,34.48 13.91,34.86 8.76,34.86 7.62,33.72 7.62,32.38 6.48,31.24 6.48,30.48 BUS_IN.8 | v49.15,7.62 49.15,8.76 51.82,11.43 51.82,18.29
  Bottom 0.508: v51.44,21.14 52.01,21.14 55.24,24.38 77.15,24.38 77.53,24 87.06,24 v88.01,24.96 | v90.49,28.77 90.87,28.77 92.58,30.48 BUS_OUT.8 | v25.53,4.76 46.29,4.76 v49.15,7.62
S3  (via drill 0.38)
  Top 0.508: 60.01,5.71 60.01,12.57 55.44,17.14 54.1,17.14 MUX.13 | 60.01,5.71 58.29,4 43.05,4 32.19,14.86 25.72,14.86 18.29,22.29 v18.29,29.15 | BUS_OUT.9 95.25,32.38 96.77,30.86 96.77,22.29 92.01,17.53 92.01,9.72 v85.34,3.05 | v62.1,3.81 60.2,5.71 60.01,5.71
  Bottom 0.508: v18.29,29.15 17.14,29.15 16.38,29.91 12,29.91 BUS_IN.9 | v85.34,3.05 62.87,3.05 v62.1,3.81
VCC  (via drill 0.38)
  Top 0.889: LED1.A 18.86,40.77 17.91,41.72 15.24,41.72 C1.1 14.86,41.91 13.53,41.91 11.24,44.2 11.24,45.72 JP1.PWR 11.24,46.1 11.24,58.48 | 11.24,58.48 20.19,58.48 IO1.2 | 11.24,58.48 7.62,58.48 IO0.2 | C3.2 60.96,44.77 58.86,44.77 53.15,50.48 53.15,54.86 56.58,58.29 58.29,58.29 IO4.2 58.67,58.29 65.34,51.63 65.34,48.58 LED_DRIVER.24 | v49.72,38.48 49.72,35.62 C2.1 | v52.2,31.24 53.91,31.24 MUX.24
  Bottom 0.889: IO15.2 96.39,8.95 84.2,8.95 IO14.2 83.82,8.95 71.44,8.95 IO13.2 71.06,8.95 58.86,8.95 IO12.2 58.29,8.95 46.1,8.95 IO11.2 45.72,8.95 33.34,8.95 IO10.2 32.96,8.95 20.77,8.95 IO9.2 20.19,8.95 7.62,8.95 IO8.2 7.24,9.14 6.86,9.14 2.67,13.34 2.67,38.1 10.29,45.72 JP1.PWR | IO7.2 96.39,58.48 84.2,58.48 IO6.2 83.82,58.48 71.25,58.48 IO5.2 70.67,58.48 70.29,58.48 66.86,55.05 61.91,55.05 58.67,58.29 IO4.2 55.82,55.82 55.82,53.72 55.05,52.96 51.24,52.96 | 51.24,52.96 51.24,40.01 v49.72,38.48 49.91,38.1 49.91,37.53 52.2,35.24 v52.2,31.24 | 51.24,52.96 45.72,58.48 IO3.2 45.34,58.48 33.15,58.48 IO2.2 32.58,58.48 20.38,58.48 IO1.2

### Text on the board
tNames: A VCC LED | 0 | 1 | 2 | 3 | 4 | 5 | 6 | 7 | !E / S2 / S0 / LE / DIN | S3 / S1 / !OE / CLK / GND | DTLJ-HEX-IO | v1 2015 | GND | GND | R3-R10 | R11-R18 | 8 | 9 | 10 | 11 | 12 | 13 | 14 | 15